# Altium schematic sheet Steppers.SchDoc
size A4; SheetNumber: 4; SheetTotal: 5
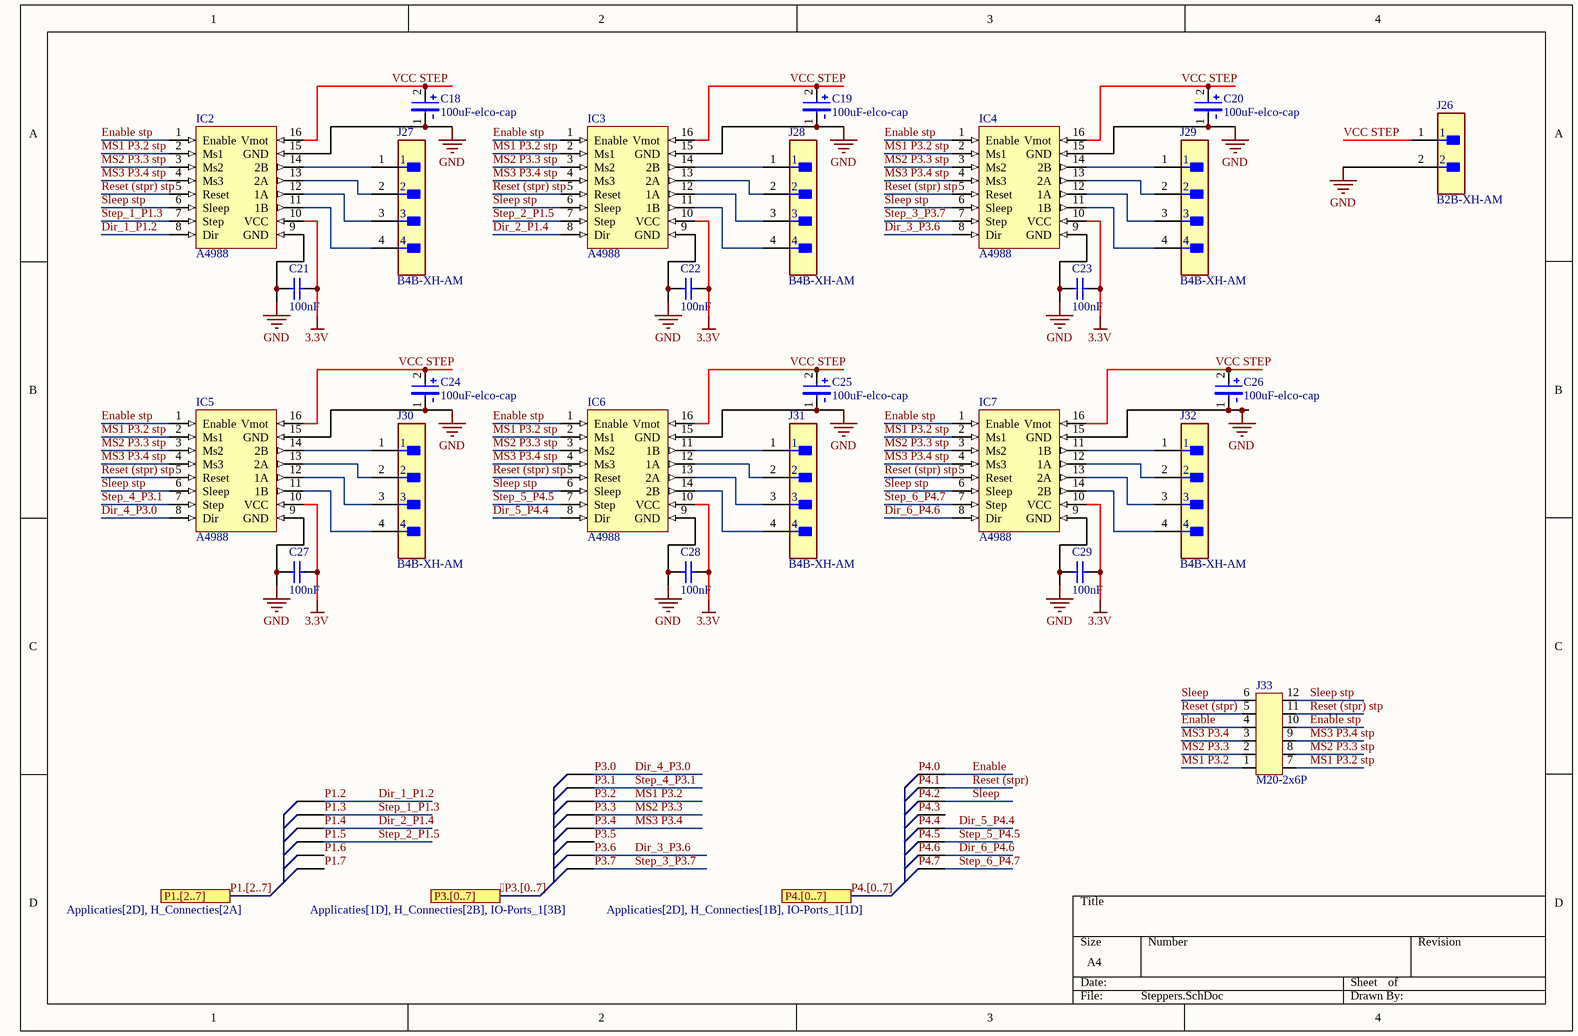
[diagram p0: Steppers.SchDoc]

## Parts
C18  100uF-elco-cap  [SMD-ELCO-CAP]
C19  100uF-elco-cap  [SMD-ELCO-CAP]
C20  100uF-elco-cap  [SMD-ELCO-CAP]
C21  100nF  [CAPC1608X90X35LL15T15]
C22  100nF  [CAPC1608X90X35LL15T15]
C23  100nF  [CAPC1608X90X35LL15T15]
C24  100uF-elco-cap  [SMD-ELCO-CAP]
C25  100uF-elco-cap  [SMD-ELCO-CAP]
C26  100uF-elco-cap  [SMD-ELCO-CAP]
C27  100nF  [CAPC1608X90X35LL15T15]
C28  100nF  [CAPC1608X90X35LL15T15]
C29  100nF  [CAPC1608X90X35LL15T15]
IC2  A4988  [A4988]
IC3  A4988  [A4988]
IC4  A4988  [A4988]
IC5  A4988  [A4988]
IC6  A4988  [A4988]
IC7  A4988  [A4988]
J26  B2B-XH-AM  [FP-B2B-XH-AM_LF_SN-MFG]
J27  B4B-XH-AM  [FP-B4B-XH-A_LF_SN-MFG]
J28  B4B-XH-AM  [FP-B4B-XH-A_LF_SN-MFG]
J29  B4B-XH-AM  [FP-B4B-XH-A_LF_SN-MFG]
J30  B4B-XH-AM  [FP-B4B-XH-A_LF_SN-MFG]
J31  B4B-XH-AM  [FP-B4B-XH-A_LF_SN-MFG]
J32  B4B-XH-AM  [FP-B4B-XH-A_LF_SN-MFG]
J33  M20-2x6P  [M20-2x6PIN]

## Ports
P1.[2..7] (see Applicaties[2D], H_Connecties[2A]), P3.[0..7] (see Applicaties[1D], H_Connecties[2B], IO-Ports_1[3B]), P4.[0..7] (see Applicaties[2D], H_Connecties[1B], IO-Ports_1[1D])

## Nets
3.3V: C21.1 C22.1 C23.1 C27.1 C28.1 C29.1 IC2.10(VCC) IC3.10(VCC) IC4.10(VCC) IC5.10(VCC) IC6.10(VCC) IC7.10(VCC)
GND: C18.1 C19.1 C20.1 C21.2 C22.2 C23.2 C24.1 C25.1 C26.1 C27.2 C28.2 C29.2 IC2.9(GND) IC2.15(GND) IC3.9(GND) IC3.15(GND) IC4.9(GND) IC4.15(GND) IC5.9(GND) IC5.15(GND) IC6.9(GND) IC6.15(GND) IC7.9(GND) IC7.15(GND) J26.2
Dir_1_P1.2: IC2.8(Dir)  [also labelled P1.2]
Dir_2_P1.4: IC3.8(Dir)  [also labelled P1.4]
Dir_3_P3.6: IC4.8(Dir)  [also labelled P3.6]
Dir_4_P3.0: IC5.8(Dir)  [also labelled P3.0]
Dir_5_P4.4: IC6.8(Dir)  [also labelled P4.4]
Dir_6_P4.6: IC7.8(Dir)  [also labelled P4.6]
Enable: J33.4  [also labelled P4.0]
Enable stp: IC2.1(Enable) IC3.1(Enable) IC4.1(Enable) IC5.1(Enable) IC6.1(Enable) IC7.1(Enable) J33.10
MS1 P3.2: J33.1  [also labelled P3.2]
MS1 P3.2 stp: IC2.2(Ms1) IC3.2(Ms1) IC4.2(Ms1) IC5.2(Ms1) IC6.2(Ms1) IC7.2(Ms1) J33.7
MS2 P3.3: J33.2  [also labelled P3.3]
MS2 P3.3 stp: IC2.3(Ms2) IC3.3(Ms2) IC4.3(Ms2) IC5.3(Ms2) IC6.3(Ms2) IC7.3(Ms2) J33.8
MS3 P3.4: J33.3  [also labelled P3.4]
MS3 P3.4 stp: IC2.4(Ms3) IC3.4(Ms3) IC4.4(Ms3) IC5.4(Ms3) IC6.4(Ms3) IC7.4(Ms3) J33.9
P1.3: IC2.7(Step)  [also labelled Step_1_P1.3]
P1.5: IC3.7(Step)  [also labelled Step_2_P1.5]
P3.1: IC5.7(Step)  [also labelled Step_~{4}_P3.1]
P3.7: IC4.7(Step)  [also labelled Step_3_P3.7]
P4.1: J33.5  [also labelled Reset (stpr)]
P4.2: J33.6  [also labelled Sleep]
P4.5: IC6.7(Step)  [also labelled Step_5_P4.5]
P4.7: IC7.7(Step)  [also labelled Step_6_P4.7]
Reset (stpr) stp: IC2.5(Reset) IC3.5(Reset) IC4.5(Reset) IC5.5(Reset) IC6.5(Reset) IC7.5(Reset) J33.11
Sleep stp: IC2.6(Sleep) IC3.6(Sleep) IC4.6(Sleep) IC5.6(Sleep) IC6.6(Sleep) IC7.6(Sleep) J33.12
VCC STEP: C18.2 C19.2 C20.2 C24.2 C25.2 C26.2 IC2.16(Vmot) IC3.16(Vmot) IC4.16(Vmot) IC5.16(Vmot) IC6.16(Vmot) IC7.16(Vmot) J26.1
NetIC2_11: IC2.11(1B) J27.4
NetIC2_12: IC2.12(1A) J27.3
NetIC2_13: IC2.13(2A) J27.2
NetIC2_14: IC2.14(2B) J27.1
NetIC3_11: IC3.11(1B) J28.4
NetIC3_12: IC3.12(1A) J28.3
NetIC3_13: IC3.13(2A) J28.2
NetIC3_14: IC3.14(2B) J28.1
NetIC4_11: IC4.11(1B) J29.4
NetIC4_12: IC4.12(1A) J29.3
NetIC4_13: IC4.13(2A) J29.2
NetIC4_14: IC4.14(2B) J29.1
NetIC5_11: IC5.11(1B) J30.4
NetIC5_12: IC5.12(1A) J30.3
NetIC5_13: IC5.13(2A) J30.2
NetIC5_14: IC5.14(2B) J30.1
NetIC6_11: IC6.11(1B) J31.1
NetIC6_12: IC6.12(1A) J31.2
NetIC6_13: IC6.13(2A) J31.3
NetIC6_14: IC6.14(2B) J31.4
NetIC7_11: IC7.11(1B) J32.1
NetIC7_12: IC7.12(1A) J32.2
NetIC7_13: IC7.13(2A) J32.3
NetIC7_14: IC7.14(2B) J32.4

## Buses and harness runs
bus P3.[0..7] =  = port P3.[0..7]
bus P1.[2..7] =  = port P1.[2..7]
bus P4.[0..7] = port P4.[0..7]

## Library data of the parts
C18-C20 C24-C26 = 100uF-elco-cap: Max 35V
C21-C23 C27-C29 = CMP-2006-02133-1: Manufacturer: AVX Interconnect / Elco; Part Number: 0603ZC101KAT2A
IC2-IC7 = A4988: stappenmotor driver
J26 = CMP-17439-000037-1: CONN HEADER VERT 2POS 2.5MM; Max Voltage Rating (AC): 250V; Connector Type: Male Pin; Contact Resistance: 20mR; Max Current Rating: 3A; Number of Positions: 2; Series: XH; Contact Material: Brass; Mount: Through Hole; Housing Material: Polyamide; Contact Plating: Tin; Termination: Solder; Max Operating Temperature: 85°C; Depth: 5.75mm; Packaging: Bulk; Min Operating Temperature: -25°C; Contact Type: Male Pin; Color: Green; Pitch: 2.5mm; Length: 7.4mm; Lead Free: Lead Free; Number of Rows: 1; Fastening Type: Detent; Housing Color: White; Orientation: Straight
J27-J32 = CMP-17439-000250-1: CONN HEADER VERT 4POS 2.5MM; Number of Contacts: 4; Contact Resistance: 20mR; Voltage Rating: 250V; Max Current Rating: 3A; Gender: Male; Wire/Cable Gauge: 22AWG; Mated Stacking Heights: 9.8mm; Insulation Resistance: 1GR; Orientation: Straight; Contact Type: Male Pin; Contact Finish - Mating: TIN; Series: XH; Max Voltage Rating (AC): 250V; Lead Pitch: 2.5mm; Contact Shape: Square; Insulation Color: Natural; Termination: Solder; Lead Free: Lead Free; Voltage Rating (AC): 250V; Number of Rows: 1; Flammability Rating: UL94 V-0; Number of Positions: 4; Max Operating Temperature: 85°C; Package Quantity: 500; Mount: Through Hole; REACH SVHC: No SVHC; Connector Type: Header; Insulation Material: Nylon; Fastening Type: Detent; Min Operating Temperature: -25°C; Housing Color: White; Packaging: Bulk; Contact Plating: Tin; Contact Material: Brass; Max Voltage Rating (DC): 250V; Housing Material: Polyamide; Color: Natural; Material: Polyamide; Pitch: 2.5mm; Depth: 5.75mm; Current Rating: 3A; Length: 12.4mm